# EAGLE schematic P27 (EAGLE 6.4)
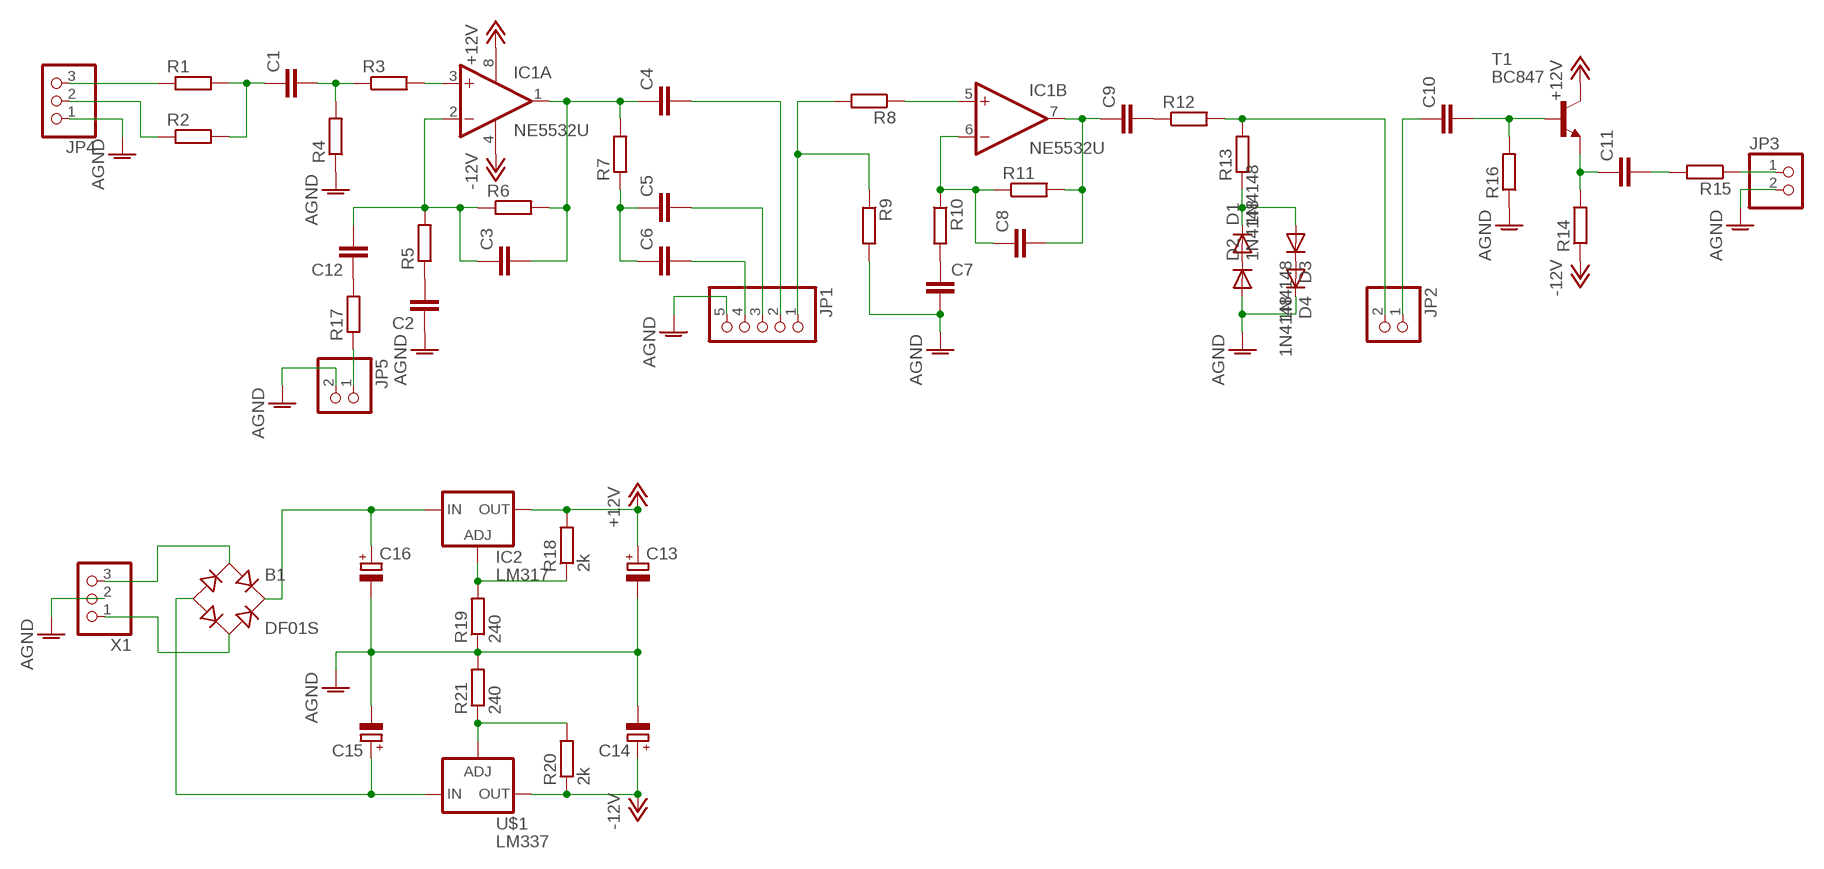
[diagram p0: schematic, sheet 1]

## Parts
B1  DF01S  [DFS]
C1  C-EUC0805K  [C0805K]
C2  C-EUC0805K  [C0805K]
C3  C-EUC0805K  [C0805K]
C4  C-EUC0805K  [C0805K]
C5  C-EUC0805K  [C0805K]
C6  C-EUC0805K  [C0805K]
C7  C-EUC0805K  [C0805K]
C8  C-EUC0805K  [C0805K]
C9  C-EUC0805K  [C0805K]
C10  C-EUC0805K  [C0805K]
C11  C-EUC0805K  [C0805K]
C12  C-EUC0805K  [C0805K]
C13  CPOL-EUD  [PANASONIC_D]
C14  CPOL-EUD  [PANASONIC_D]
C15  CPOL-EUD  [PANASONIC_D]
C16  CPOL-EUD  [PANASONIC_D]
D1  1N4148  [D0805]
D2  1N4148  [D0805]
D3  1N4148  [D0805]
D4  1N4148  [D0805]
IC1  NE5532U  [SO08]
IC2  LM317  [SOT223]
JP1  PINHD-1X5  [1X05]
JP2  PINHD-1X2  [1X02]
JP3  PINHD-1X2  [1X02]
JP4  PINHD-1X3180  [1X03]
JP5  PINHD-1X2  [1X02]
R1  R-EU_0805  [R0805]
R2  R-EU_0805  [R0805]
R3  R-EU_0805  [R0805]
R4  R-EU_0805  [R0805]
R5  R-EU_0805  [R0805]
R6  R-EU_0805  [R0805]
R7  R-EU_0805  [R0805]
R8  R-EU_0805  [R0805]
R9  R-EU_0805  [R0805]
R10  R-EU_0805  [R0805]
R11  R-EU_0805  [R0805]
R12  R-EU_0805  [R0805]
R13  R-EU_0805  [R0805]
R14  R-EU_0805  [R0805]
R15  R-EU_0805  [R0805]
R16  R-EU_0805  [R0805]
R17  R-EU_0805  [R0805]
R18  2k  R-EU_0805  [R0805]
R19  240  R-EU_0805  [R0805]
R20  2k  R-EU_0805  [R0805]
R21  240  R-EU_0805  [R0805]
T1  BC847  [SOT23]
U$1  LM337  [SOT223]
X1  W237-103  [W237-103]

## Nets
+12V: C13.+ IC1.8(A:V+) IC2.2(OUT) IC2.4(OUT) R18.2 T1.3(C)
-12V: C14.+ IC1.4(A:V-) R14.1 R20.1 U$1.3(OUT)
AGND: C2.1 C7.2 C13.- C14.- C15.- C16.- D2.A D4.K(C) JP1.5 JP3.2 JP4.1 JP5.2 R4.1 R9.2 R16.1 R19.1 R21.2 X1.2
N$1: C1.1 R1.2 R2.2
N$2: IC1.3(A:+IN) R3.2
N$3: C1.2 R3.1 R4.2
N$4: C3.1 C12.2 IC1.2(A:-IN) R5.2 R6.1
N$5: C2.2 R5.1
N$6: C3.2 C4.1 IC1.1(A:OUT) R6.2 R7.2
N$7: C6.2 JP1.4
N$8: C5.1 C6.1 R7.1
N$9: C5.2 JP1.3
N$10: C4.2 JP1.2
N$11: C10.2 R16.2 T1.1(B)
N$12: C7.1 R10.2
N$13: JP1.1 R8.2 R9.1
N$14: IC1.5(B:+IN) R8.1
N$15: C11.1 R14.2 T1.2(E)
N$16: C11.2 R15.2
N$17: C8.1 IC1.6(B:-IN) R10.1 R11.1
N$18: C8.2 C9.1 IC1.7(B:OUT) R11.2
N$19: JP3.1 R15.1
N$20: C9.2 R12.1
N$21: JP2.2 R12.2 R13.2
N$22: D1.A D2.K(C)
N$23: D3.K(C) D4.A
N$24: D1.K(C) D3.A R13.1
N$25: JP4.3 R1.1
N$26: JP4.2 R2.1
N$27: C10.1 JP2.1
N$28: B1.AC1 X1.3
N$29: C12.1 R17.2
N$30: JP5.1 R17.1
N$31: B1.AC2 X1.1
N$32: B1.+ C16.+ IC2.3(IN)
N$33: B1.- C15.+ U$1.2(IN) U$1.4(IN)
N$34: IC2.1(ADJ) R18.1 R19.2
N$38: R20.2 R21.1 U$1.1(ADJ)

## Library data of the parts
B1 = P27:DF*S: Surface Mount Glass Passivated Bridge Rectifiers Source: Source: Comchip Bridge Rectifiers DF005S-G thru DF10S-G.pdf
C1-C12 = P27:C-EU: CAPACITOR, European symbol
C13-C16 = P27:CPOL-EU: POLARIZED CAPACITOR, European symbol
D1-D4 = P27:1N4148: DIODE general purpose rectifier, 1 A
IC1 = P27:NE5532: Dual Operational Amplifier Low Power, Single-Supply, Rail-To-Rail Operational Amplifier Source: http://focus.ti.com/lit/ds/symlink/opa2345.pdf http://focus.ti.com .. opa241.pdf http://focus.ti.com/lit/ds/symlink/opa2134.pdf
IC2 = P27:LM317: 500 mA Adjustable Output Positive Voltage Regulator Source: http://www.onsemi.co.jp .. LM317M-D.PDF
JP1 = P27:PINHD-1X5: PIN HEADER
JP2 JP3 JP5 = P27:PINHD-1X2: PIN HEADER
JP4 = P27:PINHD-1X3: PIN HEADER
R1-R21 = P27:R-EU_: RESISTOR, European symbol
T1 = P27:BC847: NPN TRANSISTOR
U$1 = P27:LM337
X1 = P27:W237-103: WAGO SCREW CLAMP